# Altium schematic sheet PI_R3_REV1_BUTTONS.SchDoc
size 299 x 299 mm
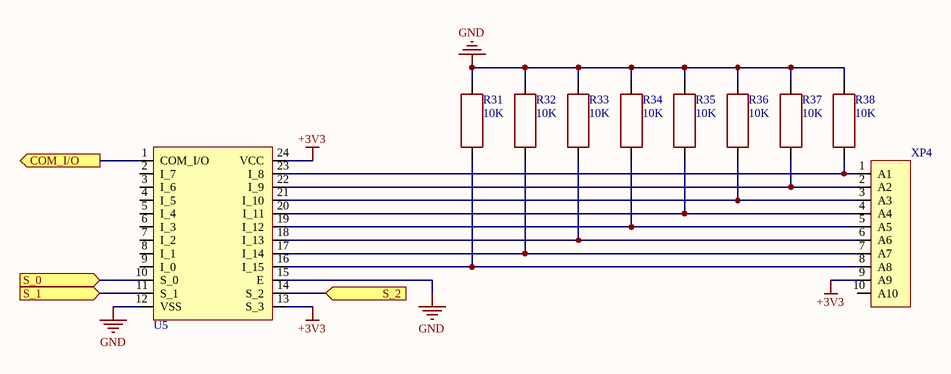
[diagram p0: PI_R3_REV1_BUTTONS.SchDoc]

## Parts
R31  value 10K  [RES: 0402]
R32  value 10K  [RES: 0402]
R33  value 10K  [RES: 0402]
R34  value 10K  [RES: 0402]
R35  value 10K  [RES: 0402]
R36  value 10K  [RES: 0402]
R37  value 10K  [RES: 0402]
R38  value 10K  [RES: 0402]
U5  CD74HC4067M96  [SOIC-24]  (value not drawn)
XP4  10FDZ-BT  [10FDZ-BT]  (value not drawn)

## Ports
COM_I/O (out), S_0 (in), S_1 (in), S_2 (in)

## Nets
+3V3: U5.13(S_3) U5.24(VCC) XP4.9(A9)
GND: R31.1 R32.1 R33.1 R34.1 R35.1 R36.1 R37.1 R38.1 U5.12(VSS) U5.15(E)
COM_I/O: U5.1(COM_I/O) ; port COM_I/O
S_0: U5.10(S_0) ; port S_0
S_1: U5.11(S_1) ; port S_1
S_2: U5.14(S_2) ; port S_2
NetR31_2: R31.2 U5.16(I_15) XP4.8(A8)
NetR32_2: R32.2 U5.17(I_14) XP4.7(A7)
NetR33_2: R33.2 U5.18(I_13) XP4.6(A6)
NetR34_2: R34.2 U5.19(I_12) XP4.5(A5)
NetR35_2: R35.2 U5.20(I_11) XP4.4(A4)
NetR36_2: R36.2 U5.21(I_10) XP4.3(A3)
NetR37_2: R37.2 U5.22(I_9) XP4.2(A2)
NetR38_2: R38.2 U5.23(I_8) XP4.1(A1)

Not connected (* = marked no-connect by the designer): U5 2(I_7) 3(I_6) 4(I_5) 5(I_4) 6(I_3) 7(I_2) 8(I_1) 9(I_0); XP4 10(A10)

## Library data of the parts
R31-R38 = Resistor_0402: Tolerance: ±5%; Product Category: Resistors; Package/Case: 0402; Temperature: -55...+125°C
U5 = CD74HC4067M96: 1 MHz, Low-Power Op Amp; Manufacturer: Texas Instruments; Datasheet: https://www.ti.com/general/docs/suppproductinfo.tsp?distId=26&gotoUrl=https://www.ti.com/lit/gpn/cd74hct4067; HelpURL: https://eu.mouser.com/ProductDetail/Texas-Instruments/CD74HC4067M96?qs=xFfolx0DHx0XT7d9xTTZBA%3D%3D; Package/Case: SOIC-24; Product Category: Multiplexers
XP4 = 10FDZ-BT: The FDZ connector, a Zero Insertion Force / (ZIF) connector, was developed to connect / FPC and membrane switch leads. This / combination of features allows greater / freedom in internal wiring designs. No / force is required to insert the leads. Once / inserted, the leads are securely held and / locked by moving the slide. The contact is / double-sided to ensure greater reliability.; Manufacturer: JST; Datasheet: https://static.chipdip.ru/lib/060/DOC000060454.pdf; HelpURL: https://www.chipdip.ru/product/10fdz-bt; Product Category: Connectors